# Altium schematic sheet 07_FPGA_banks_3_4_5.SchDoc: FPGA banks 3, 4, 5
size A3; Organization: Lime Microsystems; Address1: Surrey Tech Centre; Address2: Guildford GU2 7YG; Address3: Surrey; Address4: United Kingdom; Revision: SoDeRa-PCI v1.0; SheetNumber: 7; SheetTotal: 15
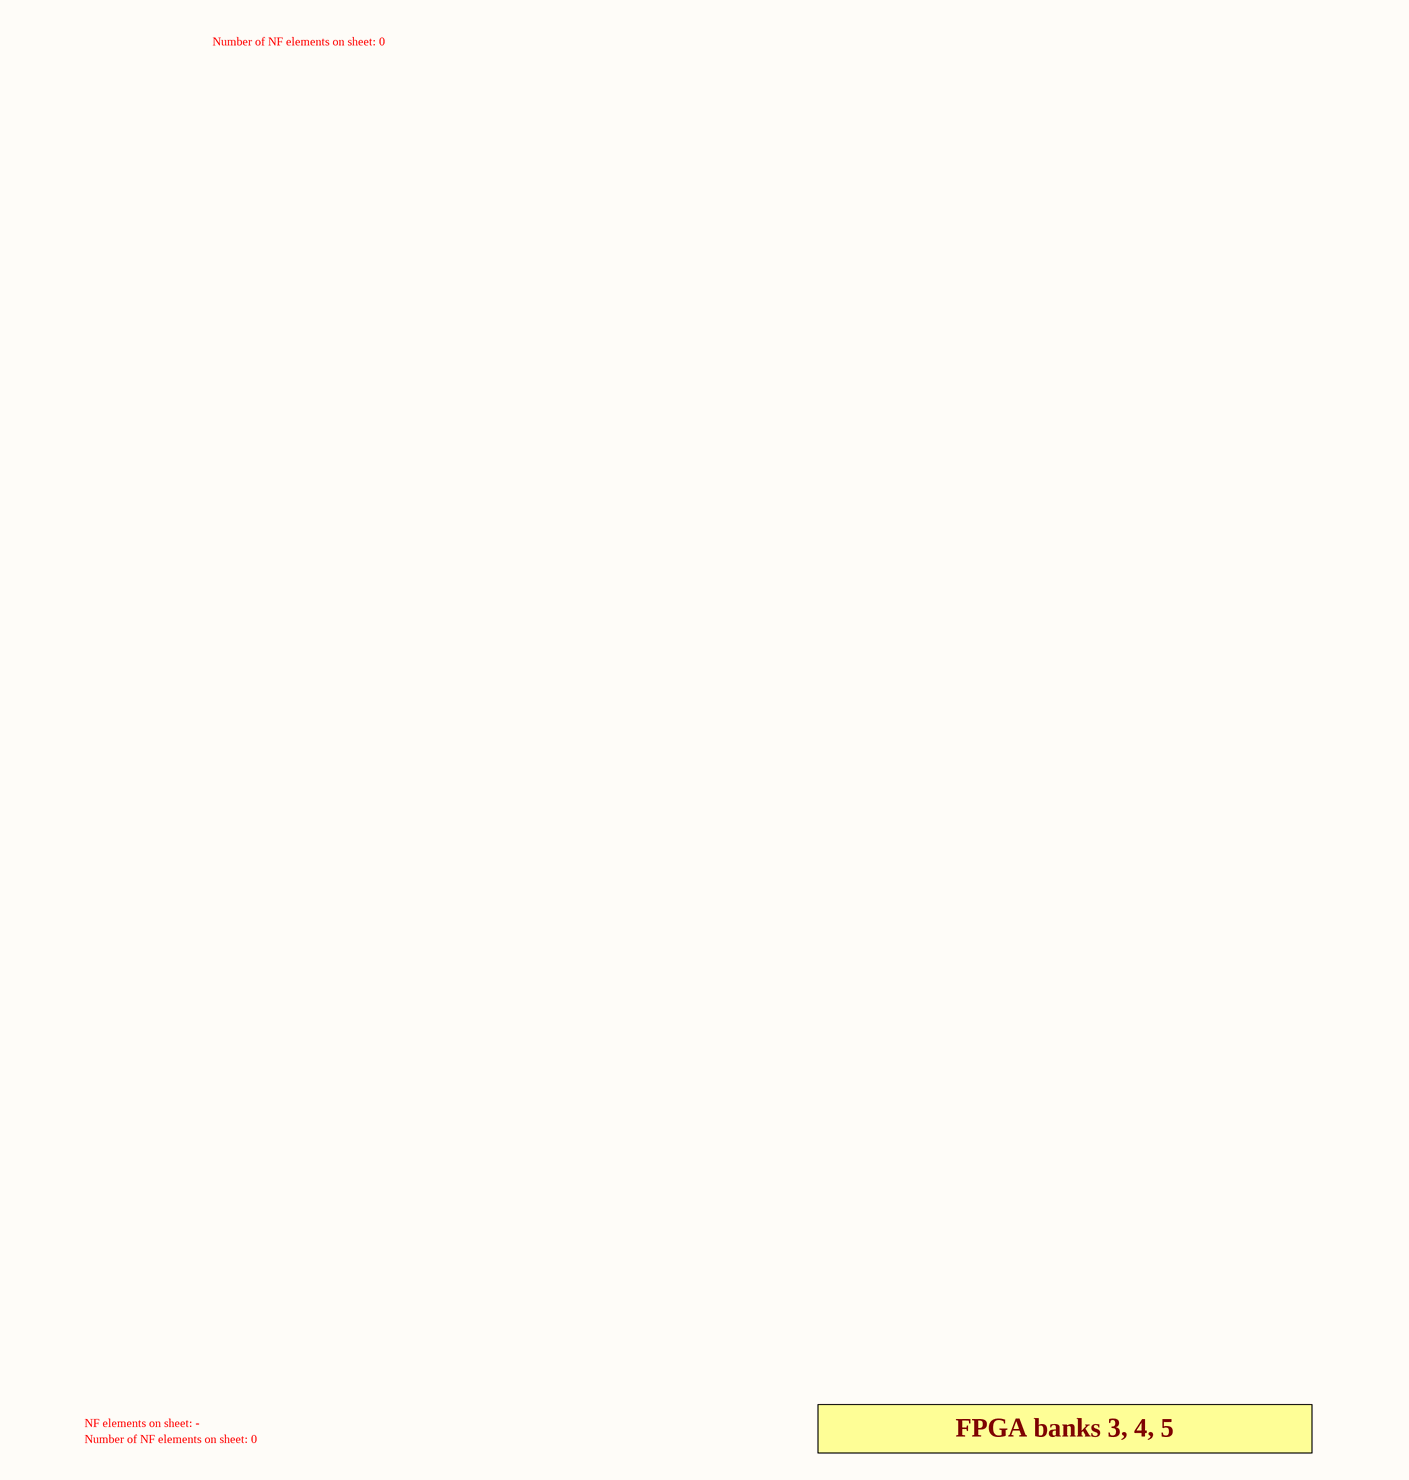
[diagram p0: 07_FPGA_banks_3_4_5.SchDoc, top]
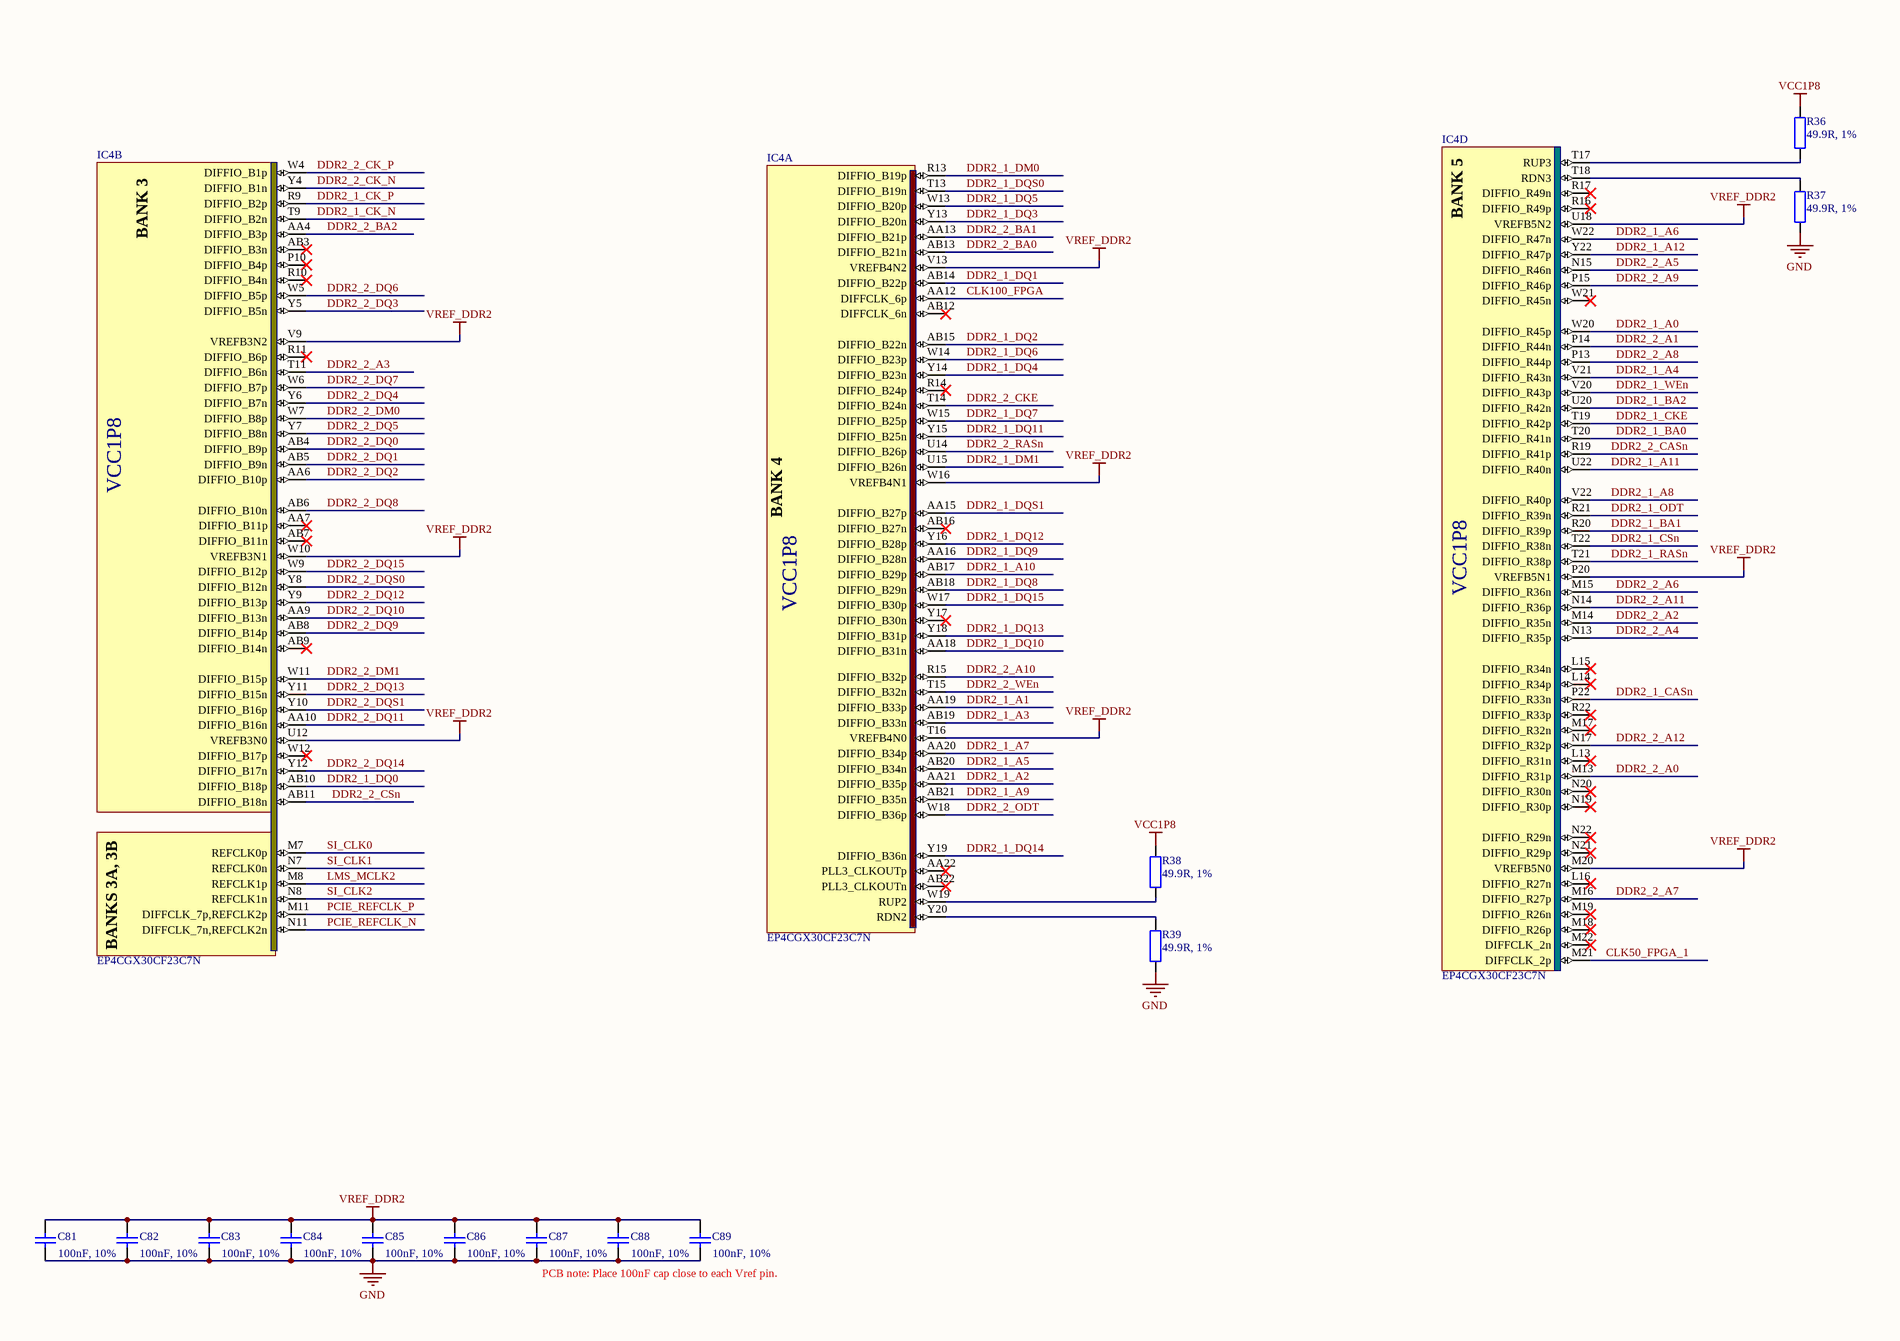
[diagram p1: 07_FPGA_banks_3_4_5.SchDoc, bottom]

## Parts
C81  100nF, 10%  [CAP0402]
C82  100nF, 10%  [CAP0402]
C83  100nF, 10%  [CAP0402]
C84  100nF, 10%  [CAP0402]
C85  100nF, 10%  [CAP0402]
C86  100nF, 10%  [CAP0402]
C87  100nF, 10%  [CAP0402]
C88  100nF, 10%  [CAP0402]
C89  100nF, 10%  [CAP0402]
IC4  EP4CGX30CF23C7N  [ALTR-FBGA484_A-200]  (parts A,B,D of 10)
R36  49.9R, 1%  [RES0402]
R37  49.9R, 1%  [RES0402]
R38  49.9R, 1%  [RES0402]
R39  49.9R, 1%  [RES0402]

## Nets
GND: C81.2 C82.2 C83.2 C84.2 C85.2 C86.2 C87.2 C88.2 C89.2 R37.1 R39.1
VCC1P8: R36.2 R38.2
VREF_DDR2: C81.1 C82.1 C83.1 C84.1 C85.1 C86.1 C87.1 C88.1 C89.1 IC4.M20(VREFB5N0) IC4.P20(VREFB5N1) IC4.T16(VREFB4N0) IC4.U12(VREFB3N0) IC4.U18(VREFB5N2) IC4.V9(VREFB3N2) IC4.V13(VREFB4N2) IC4.W10(VREFB3N1) IC4.W16(VREFB4N1)
CLK50_FPGA_1: IC4.M21(DIFFCLK_2p)
CLK100_FPGA: IC4.AA12(DIFFCLK_6p)
DDR2_1_A0: IC4.W20(DIFFIO_R45p)
DDR2_1_A1: IC4.AA19(DIFFIO_B33p)
DDR2_1_A2: IC4.AA21(DIFFIO_B35p)
DDR2_1_A3: IC4.AB19(DIFFIO_B33n)
DDR2_1_A4: IC4.V21(DIFFIO_R43n)
DDR2_1_A5: IC4.AB20(DIFFIO_B34n)
DDR2_1_A6: IC4.W22(DIFFIO_R47n)
DDR2_1_A7: IC4.AA20(DIFFIO_B34p)
DDR2_1_A8: IC4.V22(DIFFIO_R40p)
DDR2_1_A9: IC4.AB21(DIFFIO_B35n)
DDR2_1_A10: IC4.AB17(DIFFIO_B29p)
DDR2_1_A11: IC4.U22(DIFFIO_R40n)
DDR2_1_A12: IC4.Y22(DIFFIO_R47p)
DDR2_1_BA0: IC4.T20(DIFFIO_R41n)
DDR2_1_BA1: IC4.R20(DIFFIO_R39p)
DDR2_1_BA2: IC4.U20(DIFFIO_R42n)
DDR2_1_CASn: IC4.P22(DIFFIO_R33n)
DDR2_1_CK_N: IC4.T9(DIFFIO_B2n)
DDR2_1_CK_P: IC4.R9(DIFFIO_B2p)
DDR2_1_CKE: IC4.T19(DIFFIO_R42p)
DDR2_1_CSn: IC4.T22(DIFFIO_R38n)
DDR2_1_DM0: IC4.R13(DIFFIO_B19p)
DDR2_1_DM1: IC4.U15(DIFFIO_B26n)
DDR2_1_DQ0: IC4.AB10(DIFFIO_B18p)
DDR2_1_DQ1: IC4.AB14(DIFFIO_B22p)
DDR2_1_DQ2: IC4.AB15(DIFFIO_B22n)
DDR2_1_DQ3: IC4.Y13(DIFFIO_B20n)
DDR2_1_DQ4: IC4.Y14(DIFFIO_B23n)
DDR2_1_DQ5: IC4.W13(DIFFIO_B20p)
DDR2_1_DQ6: IC4.W14(DIFFIO_B23p)
DDR2_1_DQ7: IC4.W15(DIFFIO_B25p)
DDR2_1_DQ8: IC4.AB18(DIFFIO_B29n)
DDR2_1_DQ9: IC4.AA16(DIFFIO_B28n)
DDR2_1_DQ10: IC4.AA18(DIFFIO_B31n)
DDR2_1_DQ11: IC4.Y15(DIFFIO_B25n)
DDR2_1_DQ12: IC4.Y16(DIFFIO_B28p)
DDR2_1_DQ13: IC4.Y18(DIFFIO_B31p)
DDR2_1_DQ14: IC4.Y19(DIFFIO_B36n)
DDR2_1_DQ15: IC4.W17(DIFFIO_B30p)
DDR2_1_DQS0: IC4.T13(DIFFIO_B19n)
DDR2_1_DQS1: IC4.AA15(DIFFIO_B27p)
DDR2_1_ODT: IC4.R21(DIFFIO_R39n)
DDR2_1_RASn: IC4.T21(DIFFIO_R38p)
DDR2_1_WEn: IC4.V20(DIFFIO_R43p)
DDR2_2_A0: IC4.M13(DIFFIO_R31p)
DDR2_2_A1: IC4.P14(DIFFIO_R44n)
DDR2_2_A2: IC4.M14(DIFFIO_R35n)
DDR2_2_A3: IC4.T11(DIFFIO_B6n)
DDR2_2_A4: IC4.N13(DIFFIO_R35p)
DDR2_2_A5: IC4.N15(DIFFIO_R46n)
DDR2_2_A6: IC4.M15(DIFFIO_R36n)
DDR2_2_A7: IC4.M16(DIFFIO_R27p)
DDR2_2_A8: IC4.P13(DIFFIO_R44p)
DDR2_2_A9: IC4.P15(DIFFIO_R46p)
DDR2_2_A10: IC4.R15(DIFFIO_B32p)
DDR2_2_A11: IC4.N14(DIFFIO_R36p)
DDR2_2_A12: IC4.N17(DIFFIO_R32p)
DDR2_2_BA0: IC4.AB13(DIFFIO_B21n)
DDR2_2_BA1: IC4.AA13(DIFFIO_B21p)
DDR2_2_BA2: IC4.AA4(DIFFIO_B3p)
DDR2_2_CASn: IC4.R19(DIFFIO_R41p)
DDR2_2_CK_N: IC4.Y4(DIFFIO_B1n)
DDR2_2_CK_P: IC4.W4(DIFFIO_B1p)
DDR2_2_CKE: IC4.T14(DIFFIO_B24n)
DDR2_2_CSn: IC4.AB11(DIFFIO_B18n)
DDR2_2_DM0: IC4.W7(DIFFIO_B8p)
DDR2_2_DM1: IC4.W11(DIFFIO_B15p)
DDR2_2_DQ0: IC4.AB4(DIFFIO_B9p)
DDR2_2_DQ1: IC4.AB5(DIFFIO_B9n)
DDR2_2_DQ2: IC4.AA6(DIFFIO_B10p)
DDR2_2_DQ3: IC4.Y5(DIFFIO_B5n)
DDR2_2_DQ4: IC4.Y6(DIFFIO_B7n)
DDR2_2_DQ5: IC4.Y7(DIFFIO_B8n)
DDR2_2_DQ6: IC4.W5(DIFFIO_B5p)
DDR2_2_DQ7: IC4.W6(DIFFIO_B7p)
DDR2_2_DQ8: IC4.AB6(DIFFIO_B10n)
DDR2_2_DQ9: IC4.AB8(DIFFIO_B14p)
DDR2_2_DQ10: IC4.AA9(DIFFIO_B13n)
DDR2_2_DQ11: IC4.AA10(DIFFIO_B16n)
DDR2_2_DQ12: IC4.Y9(DIFFIO_B13p)
DDR2_2_DQ13: IC4.Y11(DIFFIO_B15n)
DDR2_2_DQ14: IC4.Y12(DIFFIO_B17n)
DDR2_2_DQ15: IC4.W9(DIFFIO_B12p)
DDR2_2_DQS0: IC4.Y8(DIFFIO_B12n)
DDR2_2_DQS1: IC4.Y10(DIFFIO_B16p)
DDR2_2_ODT: IC4.W18(DIFFIO_B36p)
DDR2_2_RASn: IC4.U14(DIFFIO_B26p)
DDR2_2_WEn: IC4.T15(DIFFIO_B32n)
LMS_MCLK2: IC4.M8(REFCLK1p)
PCIE_REFCLK_N: IC4.N11(DIFFCLK_7n,REFCLK2n)
PCIE_REFCLK_P: IC4.M11(DIFFCLK_7p,REFCLK2p)
SI_CLK0: IC4.M7(REFCLK0p)
SI_CLK1: IC4.N7(REFCLK0n)
SI_CLK2: IC4.N8(REFCLK1n)
NetIC4_T17: IC4.T17(RUP3) R36.1
NetIC4_T18: IC4.T18(RDN3) R37.2
NetIC4_W19: IC4.W19(RUP2) R38.1
NetIC4_Y20: IC4.Y20(RDN2) R39.2

Not connected (* = marked no-connect by the designer): IC4 AA7(DIFFIO_B11p)* AA22(PLL3_CLKOUTp)* AB3(DIFFIO_B3n)* AB7(DIFFIO_B11n)* AB9(DIFFIO_B14n)* AB12(DIFFCLK_6n)* AB16(DIFFIO_B27n)* AB22(PLL3_CLKOUTn)* L13(DIFFIO_R31n)* L14(DIFFIO_R34p)* L15(DIFFIO_R34n)* L16(DIFFIO_R27n)* M17(DIFFIO_R32n)* M18(DIFFIO_R26p)* M19(DIFFIO_R26n)* M22(DIFFCLK_2n)* N19(DIFFIO_R30p)* N20(DIFFIO_R30n)* N21(DIFFIO_R29p)* N22(DIFFIO_R29n)* P10(DIFFIO_B4p)* R10(DIFFIO_B4n)* R11(DIFFIO_B6p)* R14(DIFFIO_B24p)* R16(DIFFIO_R49p)* R17(DIFFIO_R49n)* R22(DIFFIO_R33p)* W12(DIFFIO_B17p)* W21(DIFFIO_R45n)* Y17(DIFFIO_B30n)*

## Notes on the sheet
- Number of NF elements on sheet: 0
- NF elements on sheet: -
- FPGA banks 3, 4, 5
- VCC1P8
- PCB note: Place 100nF cap close to each Vref pin.
- Title
- Size:
- Date:
- A3
- Revision:
- Time:
- Sheet
- of
- File:
- (in symbol EP4CGX30CF23C7N, part A) BANK 4
- (in symbol EP4CGX30CF23C7N, part B) BANK 3; BANKS 3A, 3B
- (in symbol EP4CGX30CF23C7N, part D) BANK 5

## Library data of the parts
C81-C89 = Cap_0603: Manufacturer: Murata; Manufacturer Part Number 1: GRM155R71C104KA88D; Brand: Murata Electronics; Type: General Purpose MLCC; Capacitance: 0.1 uF; Temperature Coefficient / Code: +/- 15 %; Voltage Rating DC: 16 V; Supplier 1: Mouser; Supplier Part Number 1: 81-GRM155R71C104KA88; Tolerance: 10 %; Case Code - in: 0402; Category: Multilayer Ceramic Capacitors MLCC - SMD/SMT; Value: 100nF, 10%; Manufacturer Part Number: GRM155R71C104KA88D
IC4 = EP4CGX30CF23C7N: Manufacturer: Altera; Voltage - Supply: 1.16 V ~ 1.24 V; Number of I/O: 290; Total RAM Bits: 1105920; Number of Logic Elements/Cells: 29440; Number of LABs/CLBs: 1840; Supplier 1: Digi-Key; Package / Case: 484-BGA; Operating Temperature: 0°C ~ 85°C; Mounting Type: Surface Mount; Number of Gates: -; Supplier Device Package: 484-FBGA (23x23); Category: Integrated Circuits (ICs); RoHS: RoHS Compliant; Supplier Part Number 1: 544-2730-ND; Manufacturer Part Number 1: EP4CGX30CF23C7N
R36-R39 = Res_0402: Manufacturer: Samsung Electro-Mechanics America, Inc.; Manufacturer Part Number: RC1005F49R9CS; Temperature Coefficient: ±100ppm/°C; Resistance (Ohms): 49.9; Power (Watts): 0.063W, 1/16W; Number of Terminations: 2; Size / Dimension: 0.039" L x 0.020" W (1.00mm x 0.50mm); Supplier Device Package: 0402 (1005 Metric); RoHS: RoHS Compliant; Supplier Part Number 1: 1276-3469-6-ND; Features: -; Packaging: Digi-Reel®; Tolerance: ±1%; Height: 0.016" (0.40mm); Category: Resistors; Composition: Thick Film; Package / Case: 0402 (1005 Metric); Supplier 1: Digi-Key; Operating Temperature: -55°C ~ 155°C; Value: 49.9R, 1%